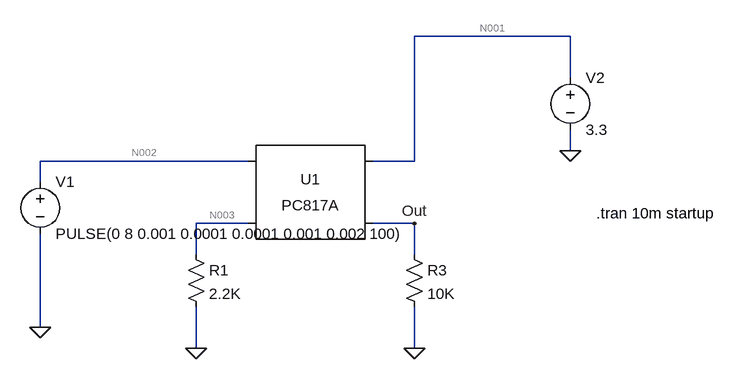
[diagram p0: schematic AirmarWaterPulseIsolator.asc]
AirmarWaterPulseIsolator.asc, the LTspice schematic file:
Version 4
SHEET 1 880 680
WIRE 608 80 368 80
WIRE 608 144 608 80
WIRE 608 256 608 224
WIRE 112 272 -208 272
WIRE 368 272 368 80
WIRE 368 272 304 272
WIRE -208 304 -208 272
WIRE 112 368 32 368
WIRE 368 368 304 368
WIRE 32 416 32 368
WIRE 368 416 368 368
WIRE -208 528 -208 384
WIRE 32 560 32 496
WIRE 368 560 368 496
FLAG 608 256 0
FLAG 368 560 0
FLAG 32 560 0
FLAG -208 528 0
FLAG 368 368 Out
SYMBOL Optos/PC817A 208 320 R0
SYMATTR InstName U1
SYMBOL res 16 400 R0
SYMATTR InstName R1
SYMATTR Value 2.2K
SYMBOL res 352 400 R0
SYMATTR InstName R3
SYMATTR Value 10K
SYMBOL voltage -208 288 R0
SYMATTR InstName V1
SYMATTR Value PULSE(0 8 0.001 0.0001 0.0001 0.001 0.002 100)
SYMBOL voltage 608 128 R0
SYMATTR InstName V2
SYMATTR Value 3.3
TEXT 648 352 Left 2 !.tran 10m startup

The netlist it stands for:
* AirmarWaterPulseIsolator.asc
XU1 N002 N003 N001 Out PC817 Igain=1m
R1 N003 0 2.2K
R3 Out 0 10K
V1 N002 0 PULSE(0 8 0.001 0.0001 0.0001 0.001 0.002 100)
V2 N001 0 3.3
.tran 10m startup
.lib PC817.sub
.backanno
.end

* Results of the author's LTspice run, read from the files saved beside the schematic
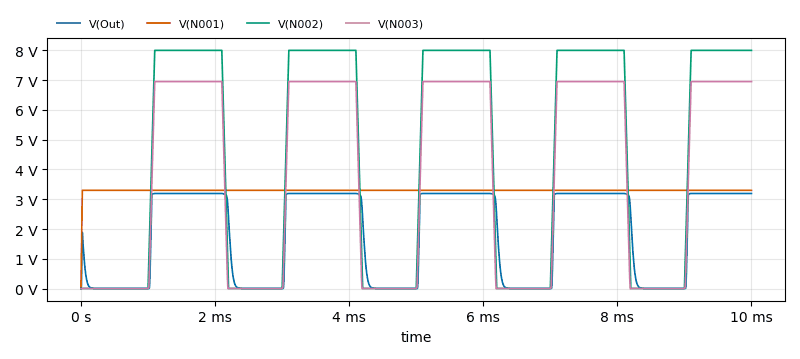
[diagram p1: Transient Analysis of AirmarWaterPulseIsolator.asc, plotted from the saved traces]
* Transient Analysis, 1 run:
*   V(Out): min 0 V, max 3.194 V, average 1.829 V, rms 2.39 V, last 3.194 V
*   V(N001): min 0 V, max 3.3 V, average 3.297 V, rms 3.298 V, last 3.3 V
*   V(N002): min 0 V, max 8 V, average 4.28 V, rms 5.773 V, last 8 V
*   V(N003): min -7.901 mV, max 6.951 V, average 3.681 V, rms 4.999 V, last 6.951 V